# EAGLE schematic sensorboard_18_DS2_dD2 (EAGLE 9.6.0)
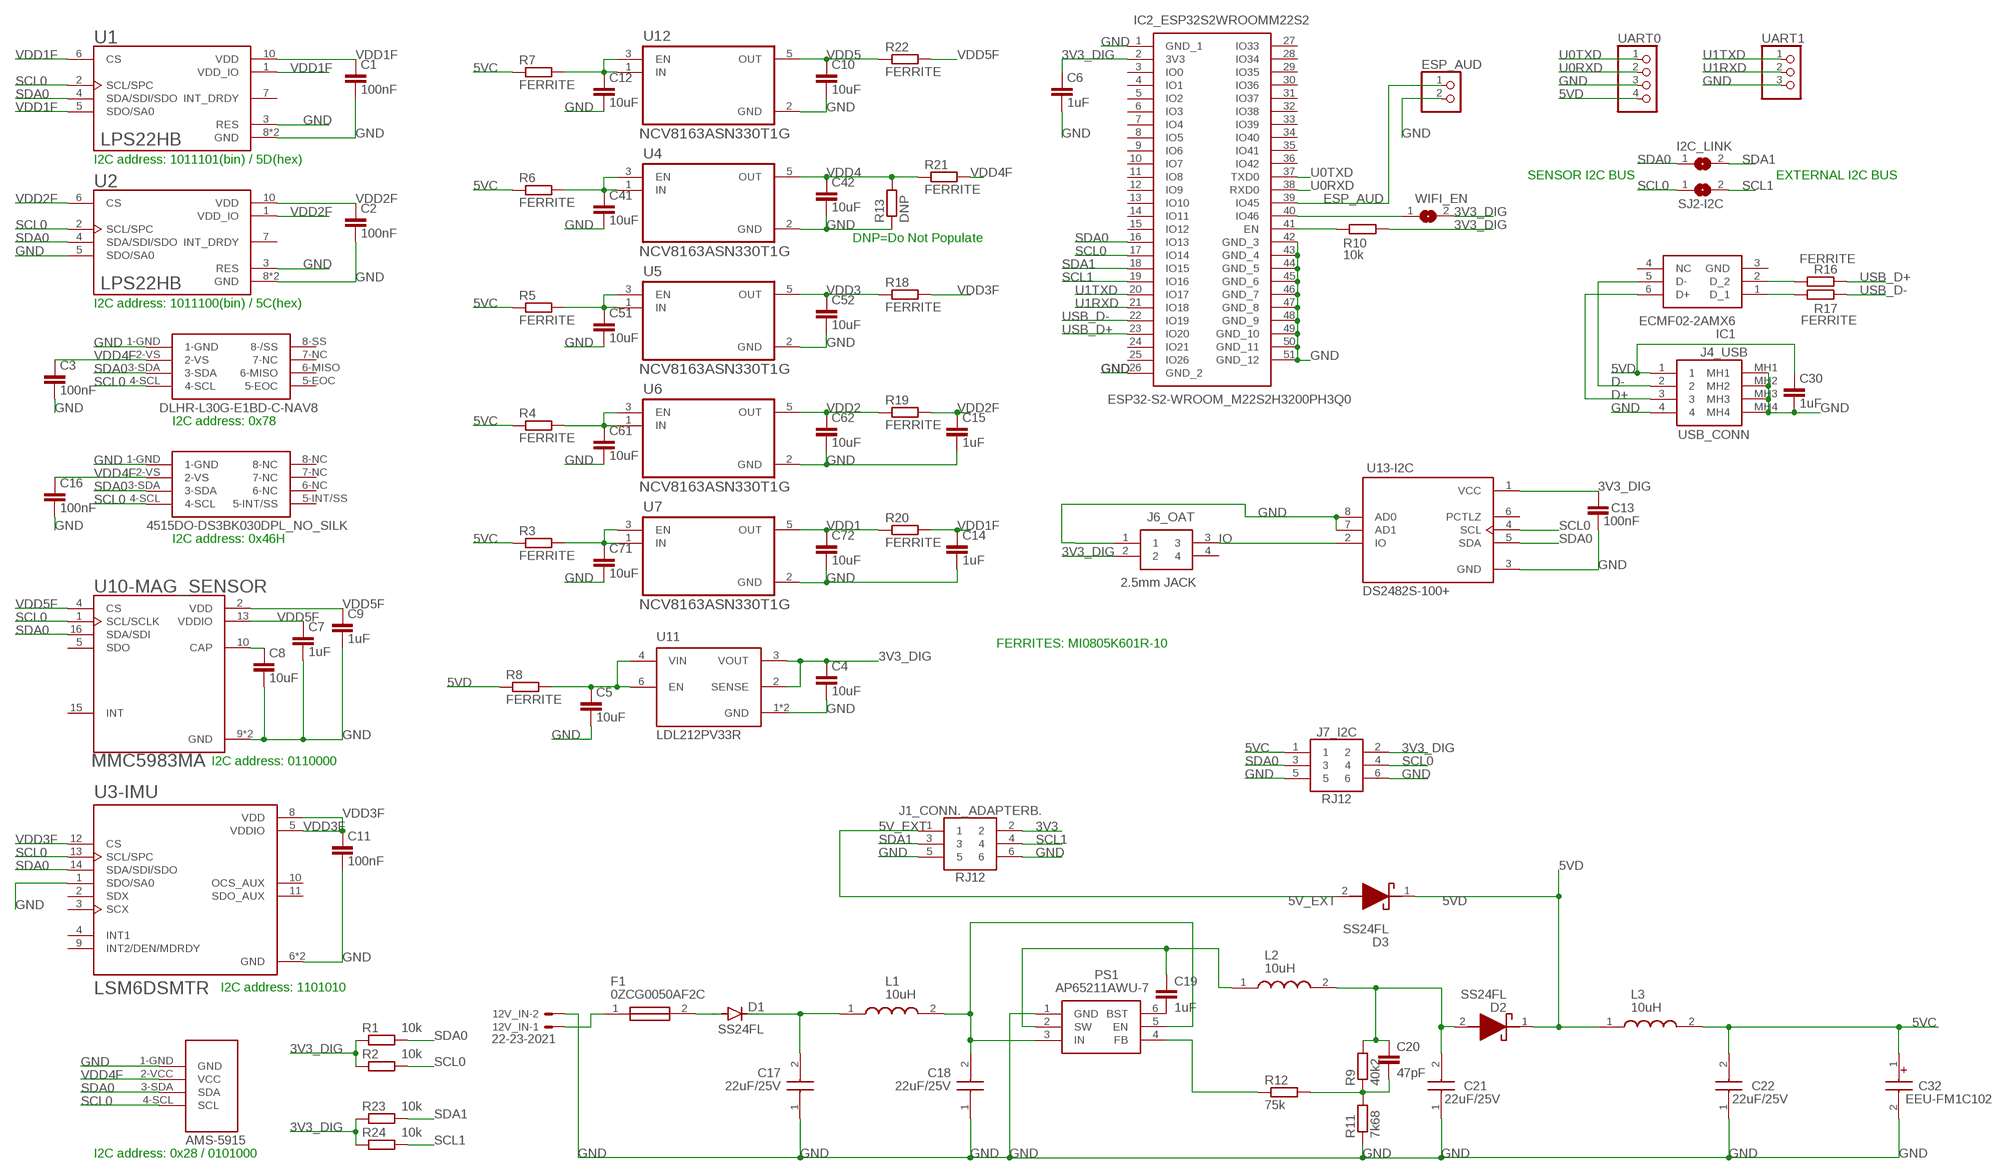
[diagram p0: schematic, sheet 1]

## Parts
12V_IN  22-23-2021  [22-23-2021]
C1  100nF  C-EUC0603  [C0603]
C2  100nF  C-EUC0603  [C0603]
C3  100nF  C-EUC0805  [C0805]
C4  10uF  C-EUC0805  [C0805]
C5  10uF  C-EUC0805  [C0805]
C6  1uF  C-EUC0805  [C0805]
C7  1uF  C-EUC0805  [C0805]
C8  10uF  C-EUC0805  [C0805]
C9  1uF  C-EUC0805  [C0805]
C10  10uF  C-EUC0805  [C0805]
C11  100nF  C-EUC0805  [C0805]
C12  10uF  C-EUC0805  [C0805]
C13  100nF  C-EUC0805  [C0805]
C14  1uF  C-EUC0805  [C0805]
C15  1uF  C-EUC0805  [C0805]
C16  100nF  C-EUC0805  [C0805]
C17  22uF/25V  CL31A226KAHNNNE  [CAPC3216X180N]
C18  22uF/25V  CL31A226KAHNNNE  [CAPC3216X180N]
C19  1uF  C-EUC0805  [C0805]
C20  47pF  C-EUC0805  [C0805]
C21  22uF/25V  CL31A226KAHNNNE  [CAPC3216X180N]
C22  22uF/25V  CL31A226KAHNNNE  [CAPC3216X180N]
C30  1uF  C-EUC0805  [C0805]
C32  EEU-FM1C102  [CAPPRD500W65D1000H2200]
C41  10uF  C-EUC0805  [C0805]
C42  10uF  C-EUC0805  [C0805]
C51  10uF  C-EUC0805  [C0805]
C52  10uF  C-EUC0805  [C0805]
C61  10uF  C-EUC0805  [C0805]
C62  10uF  C-EUC0805  [C0805]
C71  10uF  C-EUC0805  [C0805]
C72  10uF  C-EUC0805  [C0805]
D1  SS24FL  DIODE-DO-214AC  [DO-214AC]
D2  SS24FL  [SODFL3617X108N]
D3  SS24FL  [SODFL3617X108N]
ESP_AUD  PINHD-1X2  [1X02]
F1  0ZCG0050AF2C  [FUSC4632X75N]
I2C_LINK  SJ  [SJ]
IC1  ECMF02-2AMX6  [SON50P150X170X55-6N]
IC2_ESP32S2WROOMM22S2  ESP32-S2-WROOM_M22S2H3200PH3Q0  [ESP32S2WROOMM22S2H3200PH3Q0]
J1_CONN._ADAPTERB.  RJ12  SAMACSYS_615006138421"  [SAMACSYS_615006138421_MOD]
J4_USB  USB_CONN  73725-0110BLF  [737250110BLF]
J6_OAT  2.5mm JACK  SJ-2523-SMT-TR  [SJ-2523-SMT-TR]
J7_I2C  RJ12  SAMACSYS_615006138421"  [SAMACSYS_615006138421_MOD]
L1  10uH  FDSD0420-H-100M=P3  [FDSD0420WH150MP3]
L2  10uH  FDSD0420-H-100M=P3  [FDSD0420WH150MP3]
L3  10uH  FDSD0420-H-100M=P3  [FDSD0420WH150MP3]
PS1  AP65211AWU-7  [SOT95P280X90-6N]
R1  10k  R-EU_R0805  [R0805]
R2  10k  R-EU_R0805  [R0805]
R3  FERRITE  R-EU_R0805  [R0805]
R4  FERRITE  R-EU_R0805  [R0805]
R5  FERRITE  R-EU_R0805  [R0805]
R6  FERRITE  R-EU_R0805  [R0805]
R7  FERRITE  R-EU_R0805  [R0805]
R8  FERRITE  R-EU_R0805  [R0805]
R9  40k2  R-EU_R0805  [R0805]
R10  10k  R-EU_R0805  [R0805]
R11  7k68  R-EU_R0805  [R0805]
R12  75k  R-EU_R0805  [R0805]
R13  DNP  R-EU_R0805  [R0805]
R16  FERRITE  R-EU_R0805  [R0805]
R17  FERRITE  R-EU_R0805  [R0805]
R18  FERRITE  R-EU_R0805  [R0805]
R19  FERRITE  R-EU_R0805  [R0805]
R20  FERRITE  R-EU_R0805  [R0805]
R21  FERRITE  R-EU_R0805  [R0805]
R22  FERRITE  R-EU_R0805  [R0805]
R23  10k  R-EU_R0805  [R0805]
R24  10k  R-EU_R0805  [R0805]
SJ2-I2C  SJ  [SJ]
U1  LPS22HB  [LGA10R50P2X3_200X200X80]
U2  LPS22HB  [LGA10R50P2X3_200X200X80]
U3-IMU  LSM6DSMTR  [PQFN50P300X250X86-14N]
U4  NCV8163ASN330T1G  [SOP95P275X110-5N]
U5  NCV8163ASN330T1G  [SOP95P275X110-5N]
U6  NCV8163ASN330T1G  [SOP95P275X110-5N]
U7  NCV8163ASN330T1G  [SOP95P275X110-5N]
U10-MAG_SENSOR  MMC5983MA  [LGA16R50P4X4_330X330X100]
U11  LDL212PV33R  [SON50P200X200X80-7N]
U12  NCV8163ASN330T1G  [SOP95P275X110-5N]
U13-I2C  DS2482S-100+  [SOIC127P600X175-8N]
U$1  AMS-5915  [AMS-5915]
U$3  DLHR-L30G-E1BD-C-NAV8  [DLHR-L30G-E1BD-C-NAV8]
U$4  4515DO-DS3BK030DPL  4515DO-DS3BK030DPL_NO_SILKNO_SILK  [4515DO-DS3BK030DPL_NO_SILK]
UART0  PINHD-1X4  [1X04]
UART1  PINHD-1X3  [1X03]
WIFI_EN  SJ  [SJ]

## Nets
3V3: J1_CONN._ADAPTERB..2
3V3_DIG: C4.1 C6.1 C13.1 IC2_ESP32S2WROOMM22S2.2(3V3) J6_OAT.2 J7_I2C.2 R1.1 R2.1 R10.2 R23.1 R24.1 U11.2(SENSE) U11.3(VOUT) U13-I2C.1(VCC) WIFI_EN.2
5V_EXT: D3.2(A) J1_CONN._ADAPTERB..1
5VC: C22.2 C32.1(+) J7_I2C.1 L3.2 R3.1 R4.1 R5.1 R6.1 R7.1
5VD: C30.1 D2.1(K) D3.1(K) J4_USB.1 L3.1 R8.1 UART0.4
D+: IC1.6(D+) J4_USB.3
D-: IC1.5(D-) J4_USB.2
ESP_AUD: ESP_AUD.1 IC2_ESP32S2WROOMM22S2.39(IO45)
GND: 12V_IN.2 C1.2 C2.2 C3.2 C4.2 C5.2 C6.2 C7.2 C8.2 C9.2 C10.2 C11.2 C12.2 C13.2 C14.2 C15.2 C16.2 C17.1 C18.1 C21.1 C22.1 C30.2 C32.2(-) C41.2 C42.2 C51.2 C52.2 C61.2 C62.2 C71.2 C72.2 ESP_AUD.2 IC2_ESP32S2WROOMM22S2.1(GND_1) IC2_ESP32S2WROOMM22S2.26(GND_2) IC2_ESP32S2WROOMM22S2.42(GND_3) IC2_ESP32S2WROOMM22S2.43(GND_4) IC2_ESP32S2WROOMM22S2.44(GND_5) IC2_ESP32S2WROOMM22S2.45(GND_6) IC2_ESP32S2WROOMM22S2.46(GND_7) IC2_ESP32S2WROOMM22S2.47(GND_8) IC2_ESP32S2WROOMM22S2.48(GND_9) IC2_ESP32S2WROOMM22S2.49(GND_10) IC2_ESP32S2WROOMM22S2.50(GND_11) IC2_ESP32S2WROOMM22S2.51(GND_12) J1_CONN._ADAPTERB..5 J1_CONN._ADAPTERB..6 J4_USB.4 J4_USB.MH1 J4_USB.MH2 J4_USB.MH3 J4_USB.MH4 J6_OAT.1 J7_I2C.5 J7_I2C.6 PS1.1(GND) R11.1 R13.1 U1.3(RES) U1.8(GND) U1.9(GND) U2.3(RES) U2.5(SDO/SA0) U2.8(GND) U2.9(GND) U3-IMU.1(SDO/SA0) U3-IMU.6(GND) U3-IMU.7(GND) U4.2(GND) U5.2(GND) U6.2(GND) U7.2(GND) U10-MAG_SENSOR.9(GND) U10-MAG_SENSOR.11(GND) U11.1(GND) U11.7(GND) U12.2(GND) U13-I2C.3(GND) U13-I2C.7(AD1) U13-I2C.8(AD0) U$1.1-GND(GND) U$3.1-GND U$4.1-GND UART0.3 UART1.3
IO: J6_OAT.3 U13-I2C.2(IO)
N$2: C8.1 U10-MAG_SENSOR.10(CAP)
N$7: IC2_ESP32S2WROOMM22S2.41(EN) R10.1
N$9: C17.2 D1.C L1.1
N$13: C18.2 L1.2 PS1.3(IN) PS1.5(EN)
N$16: C20.2 R9.1 R11.2 R12.2
N$17: C19.1 L2.1 PS1.2(SW)
N$18: PS1.4(FB) R12.1
N$20: C19.2 PS1.6(BST)
N$24: 12V_IN.1 F1.1
N$25: IC2_ESP32S2WROOMM22S2.40(IO46) WIFI_EN.1
N$27: IC1.1(D_1) R17.1
N$28: IC1.2(D_2) R16.1
N$32: D1.A F1.2
N$33: C20.1 C21.2 D2.2(A) L2.2 R9.2
SCL0: IC2_ESP32S2WROOMM22S2.17(IO14) J7_I2C.4 R2.2 SJ2-I2C.1 U1.2(SCL/SPC) U2.2(SCL/SPC) U3-IMU.13(SCL/SPC) U10-MAG_SENSOR.1(SCL/SCLK) U13-I2C.4(SCL) U$1.4-SCL(SCL) U$3.4-SCL U$4.4-SCL
SCL1: IC2_ESP32S2WROOMM22S2.19(IO16) J1_CONN._ADAPTERB..4 R24.2 SJ2-I2C.2
SDA0: I2C_LINK.1 IC2_ESP32S2WROOMM22S2.16(IO13) J7_I2C.3 R1.2 U1.4(SDA/SDI/SDO) U2.4(SDA/SDI/SDO) U3-IMU.14(SDA/SDI/SDO) U10-MAG_SENSOR.16(SDA/SDI) U13-I2C.5(SDA) U$1.3-SDA(SDA) U$3.3-SDA U$4.3-SDA
SDA1: I2C_LINK.2 IC2_ESP32S2WROOMM22S2.18(IO15) J1_CONN._ADAPTERB..3 R23.2
U0RXD: IC2_ESP32S2WROOMM22S2.38(RXD0) UART0.2
U0TXD: IC2_ESP32S2WROOMM22S2.37(TXD0) UART0.1
U1RXD: IC2_ESP32S2WROOMM22S2.21(IO18) UART1.2
U1TXD: IC2_ESP32S2WROOMM22S2.20(IO17) UART1.1
USB_D+: IC2_ESP32S2WROOMM22S2.23(IO20) R16.2
USB_D-: IC2_ESP32S2WROOMM22S2.22(IO19) R17.2
VDD1: C72.1 R20.1 U7.5(OUT)
VDD1F: C1.1 C14.1 R20.2 U1.1(VDD_IO) U1.5(SDO/SA0) U1.6(CS) U1.10(VDD)
VDD1P: C71.1 R3.2 U7.1(IN) U7.3(EN)
VDD2: C62.1 R19.1 U6.5(OUT)
VDD2F: C2.1 C15.1 R19.2 U2.1(VDD_IO) U2.6(CS) U2.10(VDD)
VDD2P: C61.1 R4.2 U6.1(IN) U6.3(EN)
VDD3: C52.1 R18.1 U5.5(OUT)
VDD3F: C11.1 R18.2 U3-IMU.5(VDDIO) U3-IMU.8(VDD) U3-IMU.12(CS)
VDD3P: C51.1 R5.2 U5.1(IN) U5.3(EN)
VDD4: C42.1 R13.2 R21.1 U4.5(OUT)
VDD4F: C3.1 C16.1 R21.2 U$1.2-VCC(VCC) U$3.2-VS U$4.2-VS
VDD4P: C41.1 R6.2 U4.1(IN) U4.3(EN)
VDD5: C10.1 R22.1 U12.5(OUT)
VDD5F: C7.1 C9.1 R22.2 U10-MAG_SENSOR.2(VDD) U10-MAG_SENSOR.4(CS) U10-MAG_SENSOR.13(VDDIO)
VDD5P: C12.1 R7.2 U12.1(IN) U12.3(EN)
VDD_DIGP: C5.1 R8.2 U11.4(VIN) U11.6(EN)
Unconnected: IC1.4(NC) IC2_ESP32S2WROOMM22S2.3(IO0) IC2_ESP32S2WROOMM22S2.4(IO1) IC2_ESP32S2WROOMM22S2.5(IO2) IC2_ESP32S2WROOMM22S2.6(IO3) IC2_ESP32S2WROOMM22S2.7(IO4) IC2_ESP32S2WROOMM22S2.8(IO5) IC2_ESP32S2WROOMM22S2.9(IO6) IC2_ESP32S2WROOMM22S2.10(IO7) IC2_ESP32S2WROOMM22S2.11(IO8) IC2_ESP32S2WROOMM22S2.12(IO9) IC2_ESP32S2WROOMM22S2.13(IO10) IC2_ESP32S2WROOMM22S2.14(IO11) IC2_ESP32S2WROOMM22S2.15(IO12) IC2_ESP32S2WROOMM22S2.24(IO21) IC2_ESP32S2WROOMM22S2.25(IO26) IC2_ESP32S2WROOMM22S2.27(IO33) IC2_ESP32S2WROOMM22S2.28(IO34) IC2_ESP32S2WROOMM22S2.29(IO35) IC2_ESP32S2WROOMM22S2.30(IO36) IC2_ESP32S2WROOMM22S2.31(IO37) IC2_ESP32S2WROOMM22S2.32(IO38) IC2_ESP32S2WROOMM22S2.33(IO39) IC2_ESP32S2WROOMM22S2.34(IO40) IC2_ESP32S2WROOMM22S2.35(IO41) IC2_ESP32S2WROOMM22S2.36(IO42) J6_OAT.4 U1.7(INT_DRDY) U2.7(INT_DRDY) U3-IMU.2(SDX) U3-IMU.3(SCX) U3-IMU.4(INT1) U3-IMU.9(INT2/DEN/MDRDY) U3-IMU.10(OCS_AUX) U3-IMU.11(SDO_AUX) U10-MAG_SENSOR.5(SDO) U10-MAG_SENSOR.15(INT) U13-I2C.6(PCTLZ) U$3.5-EOC U$3.6-MISO U$3.7-NC U$3.8-SS(8-/SS) U$4.5-INT/SS U$4.6-NC U$4.7-NC U$4.8-NC

## Notes on the sheet
- I2C address: 1011101(bin) / 5D(hex)
- SENSOR I2C BUS | EXTERNAL I2C BUS
- DNP=Do Not Populate
- I2C address: 1011100(bin) / 5C(hex)
- I2C address: 0x78
- I2C address: 0x46H
- FERRITES: MI0805K601R-10
- I2C address: 0110000
- I2C address: 1101010
- I2C address: 0x28 / 0101000

## Power pins joined to a net without a drawn wire
GND: IC1.3(GND)

## Library data of the parts
12V_IN = con-molex:22-23-2021: .100" (2.54mm) Center Header - 2 Pin; MF: MOLEX; MPN: 22-23-2021; OC_FARNELL: 1462926; OC_NEWARK: 25C3832
C1-C16 C19 C20 C30 C41 C42 C51 C52 C61 C62 C71 C72 = rcl:C-EU: CAPACITOR, European symbol; SPICEPREFIX: C
C17 C18 C21 C22 = SamacSys_Parts:CL31A226KAHNNNE: SAMSUNG ELECTRO-MECHANICS - CL31A226KAHNNNE - CAP, 22UF, 25V, MLCC, 1206 Source: Datasheet <http://www.samsungsem.com/kr/support/product-search/mlcc/CL31A226KAHNNNE.jsp>; DESCRIPTION: SAMSUNG ELECTRO-MECHANICS - CL31A226KAHNNNE - CAP, 22UF, 25V, MLCC, 1206; HEIGHT: 1.8mm; MANUFACTURER_NAME: Samsung Electro-Mechanics; MANUFACTURER_PART_NUMBER: CL31A226KAHNNNE; MOUSER_PART_NUMBER: N/A; MOUSER_PRICE-STOCK: https://www.mouser.com/Search/Refine.aspx?Keyword=N%2FA
C32 = SamacSys_Parts:EEU-FM1C102: Al Electrolytic Cap 105C 16V 1000uF Panasonic 1000uF 16 V dc Aluminium Electrolytic Capacitor, FM Series 5000h 10 Dia. x 20mm Source: Datasheet <http://industrial.panasonic.com/cdbs/www-data/pdf/RDF0000/ABA0000C1018.pdf>; DESCRIPTION: Al Electrolytic Cap 105C 16V 1000uF Panasonic 1000uF 16 V dc Aluminium Electrolytic Capacitor, FM Series 5000h 10 Dia. x 20mm; HEIGHT: 22mm; MANUFACTURER_NAME: Panasonic; MANUFACTURER_PART_NUMBER: EEU-FM1C102; MOUSER_PART_NUMBER: 667-EEU-FM1C102; MOUSER_PRICE-STOCK: https://www.mouser.co.uk/ProductDetail/Panasonic/EEU-FM1C102?qs=MtOUKumLmnZ3b%252BuCdcXLJA%3D%3D
D1 = diode:DIODE-: DIODE
D2 D3 = SamacSys_Parts:SS24FL: ON SEMICONDUCTOR - SS24FL - SCHOTTKY RECT, AEC-Q101, 40V, SOD-123F Source: Datasheet <https://www.onsemi.com/pub/Collateral/SS26FL-D.PDF>; DESCRIPTION: ON SEMICONDUCTOR - SS24FL - SCHOTTKY RECT, AEC-Q101, 40V, SOD-123F; HEIGHT: 1.08mm; MANUFACTURER_NAME: ON Semiconductor; MANUFACTURER_PART_NUMBER: SS24FL; MOUSER_PART_NUMBER: 512-SS24FL; MOUSER_PRICE-STOCK: https://www.mouser.co.uk/ProductDetail/ON-Semiconductor-Fairchild/SS24FL?qs=tqW9UTzndZyvT5hdH%252BfSxg%3D%3D
ESP_AUD = pinhead:PINHD-1X2: PIN HEADER
F1 = SamacSys_Parts:0ZCG0050AF2C: Resettable Fuses - PPTC Fuse Source: Datasheet <http://belfuse.com/pdfs/0ZCG.pdf>; DESCRIPTION: Resettable Fuses - PPTC Fuse; HEIGHT: 0.75mm; MANUFACTURER_NAME: Stewart Connector; MANUFACTURER_PART_NUMBER: 0ZCG0050AF2C; MOUSER_PART_NUMBER: 530-0ZCG0050AF2C; MOUSER_PRICE-STOCK: https://www.mouser.co.uk/ProductDetail/Bel-Fuse/0ZCG0050AF2C?qs=SRYZG9HaIQ0mNZjboPT99Q%3D%3D
I2C_LINK SJ2-I2C WIFI_EN = jumper:SJ: SMD solder JUMPER
IC1 = ECMF02-2AMX6:ECMF02-2AMX6: Common Mode Filter & ESD Prot. USB uQFN6 STMicroelectronics ECMF02 Series, Signal Filter, 200mA uQFN SMD, Flat Contact Termination, 1.8 x 1.6 x 0.5mm Source: Datasheet <http://www.st.com/content/ccc/resource/technical/document/datasheet/3a/28/cf/d0/31/63/48/8c/CD00282307.pdf/files/CD00282307.pdf/jcr:content/translations/en.CD00282307.pdf> Check prices <https://pricing.snapeda.com/parts/ECMF02-2AMX6/STMicroelectronics/view-part?ref=eda>; AVAILABILITY: Good; DESCRIPTION: 2 Line Common Mode Choke Surface Mount 200mA DCR 2.5Ohm; MF: STMicroelectronics; MP: ECMF02-2AMX6; PACKAGE: UFQFN-6 STMicroelectronics; PRICE: None; PURCHASE-URL: https://pricing.snapeda.com/search/part/ECMF02-2AMX6/?ref=eda
IC2_ESP32S2WROOMM22S2 = SamacSys_Parts:ESP32-S2-WROOM_M22S2H3200PH3Q0: WiFi Modules (802.11) Module ESP32-S2 WROOM PCB ANT Source: Datasheet; DESCRIPTION: WiFi Modules (802.11) Module ESP32-S2 WROOM PCB ANT; HEIGHT: 3.45mm; MANUFACTURER_NAME: Espressif Systems; MANUFACTURER_PART_NUMBER: ESP32-S2-WROOM(M22S2H3200PH3Q0); MOUSER_PART_NUMBER: 356-ESP32S2WRM3200PH; MOUSER_PRICE-STOCK: https://www.mouser.co.uk/ProductDetail/Espressif-Systems/ESP32-S2-WROOMM22S2H3200PH3Q0?qs=vHuUswq2%252BsxRlbezmiT%252B3g%3D%3D
J1_CONN._ADAPTERB. J7_I2C = Sensor_Board_DS2:SAMACSYS_615006138421: HORIZONTAL PLASTIC 6P6C MODULAR JACK TAP UP Source: Datasheet <http://docs-emea.rs-online.com/webdocs/0f88/0900766b80f88670.pdf>
J4_USB = SamacSys_Parts:73725-0110BLF: USB Connectors USB UP RIGHT RECEP W/O SENSOR FLAG Source: Datasheet; DESCRIPTION: USB Connectors USB UP RIGHT RECEP W/O SENSOR FLAG; HEIGHT: 14.03mm; MANUFACTURER_NAME: Amphenol; MANUFACTURER_PART_NUMBER: 73725-0110BLF; MOUSER_PART_NUMBER: 649-73725-0110BLF; MOUSER_PRICE-STOCK: https://www.mouser.co.uk/ProductDetail/Amphenol-FCI/73725-0110BLF?qs=x6EjVpvqMVP%252BaDTVID3rTA%3D%3D
J6_OAT = SamacSys_Parts:SJ-2523-SMT-TR: 2.5 MM AUDIO JACK Source: Datasheet <http://www.cui.com/product/resource/digikeypdf/sj-252x-smt_series.pdf>; ARROW_PART_NUMBER: SJ-2523-SMT-TR; ARROW_PRICE-STOCK: https://www.arrow.com/en/products/sj-2523-smt-tr/cui-devices; DESCRIPTION: 2.5 MM AUDIO JACK; HEIGHT: mm; MANUFACTURER_NAME: CUI Inc.; MANUFACTURER_PART_NUMBER: SJ-2523-SMT-TR; MOUSER_PART_NUMBER: 490-SJ-2523-SMT-TR; MOUSER_PRICE-STOCK: https://www.mouser.co.uk/ProductDetail/CUI-Devices/SJ-2523-SMT-TR/?qs=WyjlAZoYn50TRxpi%2FhdHvw%3D%3D
L1-L3 = SamacSys_Parts:FDSD0420-H-100M=P3: Toko FDSD0420 Series Shielded Wire-wound SMD Inductor with a Powered Iron Core, 10 uH Wire-Wound 3.3A Idc Source: Datasheet <https://psearch.en.murata.com/inductor/product/FDSD0420-H-100M#.html>; DESCRIPTION: Toko FDSD0420 Series Shielded Wire-wound SMD Inductor with a Powered Iron Core, 10 uH Wire-Wound 3.3A Idc; HEIGHT: 2mm; MANUFACTURER_NAME: Murata Electronics; MANUFACTURER_PART_NUMBER: FDSD0420-H-100M=P3; MOUSER_PART_NUMBER: 81-FDSD0420-H-100MP3; MOUSER_PRICE-STOCK: https://www.mouser.co.uk/ProductDetail/Murata-Electronics/FDSD0420-H-100M%3dP3?qs=KuGPmAKtFKXZ0m3Q9jeEIg%3D%3D
PS1 = SamacSys_Parts:AP65211AWU-7: Switching Voltage Regulators DCDC Conv HV Buck Source: Datasheet <https://componentsearchengine.com/Datasheets/1/AP65211AWU-7.pdf>; DESCRIPTION: Switching Voltage Regulators DCDC Conv HV Buck; HEIGHT: 0.9mm; MANUFACTURER_NAME: Diodes Inc.; MANUFACTURER_PART_NUMBER: AP65211AWU-7; MOUSER_PART_NUMBER: 621-AP65211AWU-7; MOUSER_PRICE-STOCK: https://www.mouser.co.uk/ProductDetail/Diodes-Incorporated/AP65211AWU-7?qs=HXFqYaX1Q2yDqQLsq3DZAg%3D%3D
R1-R13 R16-R24 = rcl:R-EU_: RESISTOR, European symbol; SPICEPREFIX: R
U1 U2 = LPS22HB:LPS22HB: MEMS nano pressure sensor: 260-1260 hPa absolute digital output barometer; AVAILABILITY: Unavailable; DESCRIPTION: Pressure Sensor 3.77PSI ~ 18.27PSI (26kPa ~ 126kPa) Absolute 24 b 10-WFLGA Exposed Pad; MF: STMicroelectronics; MP: LPS22HB; PACKAGE: WFLGA-10 STMicroelectronics; PRICE: None
U3-IMU = LSM6DSMTR:LSM6DSMTR: iNEMO inertial module: 3D accelerometer and 3D gyroscope Check prices <https://snapeda.com/parts/LSM6DSMTR/STMicroelectronics/view-part/?ref=eda>; ARROW_ELECTRONICS-PURCHASE-URL: https://snapeda.com/shop?store=Arrow+Electronics&id=581716; AVAILABILITY: Good; DESCRIPTION: Accelerometer, Gyroscope, Temperature, 6 Axis Sensor I²C, SPI Output; DIGIKEY-PURCHASE-URL: https://snapeda.com/shop?store=DigiKey&id=581716; MF: STMicroelectronics; MOUSER-PURCHASE-URL: https://snapeda.com/shop?store=Mouser&id=581716; MP: LSM6DSMTR; PACKAGE: VFLGA-14 STMicroelectronics; PRICE: None
U4-U7 U12 = NCV8163ASN330T1G:NCV8163ASN330T1G: None Check prices <https://snapeda.com/parts/NCV8163ASN330T1G/ON%20Semiconductor/view-part/?ref=eda>; AVAILABILITY: Warning; DESCRIPTION: Linear Voltage Regulator IC 1 Output 250mA 5-TSOP; MF: ON Semiconductor; MOUSER-PURCHASE-URL: https://snapeda.com/shop?store=Mouser&id=3218317; MP: NCV8163ASN330T1G; PACKAGE: TSOP-5 ON Semiconductor; PRICE: None
U10-MAG_SENSOR = FIS1100:MMC5983MA: MMC5983MA Magnetometer; ARROW_ELECTRONICS-PURCHASE-URL: https://snapeda.com/shop?store=Arrow+Electronics&id=1392125; AVAILABILITY: Good; DESCRIPTION: Accelerometer, Gyroscope, 6 Axis Sensor I²C Output; DIGIKEY-PURCHASE-URL: https://snapeda.com/shop?store=DigiKey&id=1392125; MF: ON Semiconductor; MP: FIS1100; PACKAGE: VFLGA-16 ON Semiconductor; PRICE: None
U11 = LDL212PV33R:LDL212PV33R: Linear Voltage Regulator IC 1 Output 1.2A 6-DFN (2x2) Check prices <https://snapeda.com/parts/LDL212PV33R/STMicroelectronics/view-part/?ref=eda>; ARROW_ELECTRONICS-PURCHASE-URL: https://snapeda.com/shop?store=Arrow+Electronics&id=4551149; AVAILABILITY: Good; DESCRIPTION: Linear Voltage Regulator IC 1 Output 1.2A 6-DFN (2x2); DIGIKEY-PURCHASE-URL: https://snapeda.com/shop?store=DigiKey&id=4551149; MF: STMicroelectronics; MOUSER-PURCHASE-URL: https://snapeda.com/shop?store=Mouser&id=4551149; MP: LDL212PV33R; PACKAGE: DFN-6 STMicroelectronics; PRICE: None
U13-I2C = DS2482S-100_:DS2482S-100+: DS2460S Series 5.5 V 400 kHz I2C Surface Mount Smart Card Interface IC - SOIC-8 Check prices <https://snapeda.com/parts/DS2482S-100%2B/Maxim%20Integrated/view-part/?ref=eda>; AVAILABILITY: Warning; DESCRIPTION: 1-Wire® Bridge, 1-Wire® to I²C I²C Interface 8-SOIC; DIGIKEY-PURCHASE-URL: https://snapeda.com/shop?store=DigiKey&id=587620; MF: Maxim Integrated; MOUSER-PURCHASE-URL: https://snapeda.com/shop?store=Mouser&id=587620; MP: DS2482S-100+; PACKAGE: SOIC-8 Maxim; PRICE: None
U$1 = pressure_01:AMS-5915
U$3 = pressure_01:DLHR-L30G-E1BD-C-NAV8; DLHR-L30G-E1BD-C-NAV8: DLHR-L30G-E1BD-C-NAV8
U$4 = pressure_01:4515DO-DS3BK030DPL_NO_SILK
UART0 = pinhead:PINHD-1X4: PIN HEADER
UART1 = pinhead:PINHD-1X3: PIN HEADER

## Net classes
0 default: clearance 0.205 mm